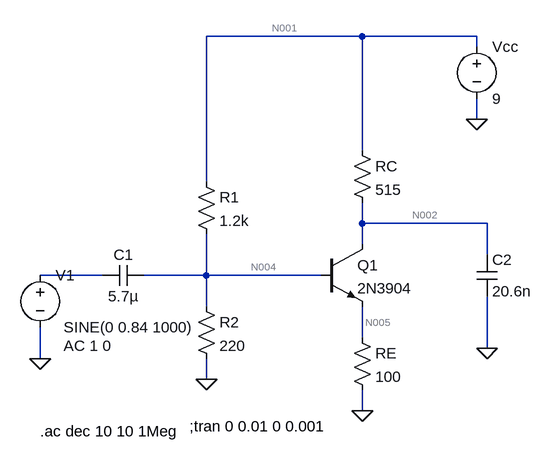
[diagram p0: schematic CE_amp.asc]
CE_amp.asc, the LTspice schematic file:
Version 4
SHEET 1 1264 680
WIRE 384 -208 144 -208
WIRE 560 -208 384 -208
WIRE 560 -192 560 -208
WIRE 560 -80 560 -112
WIRE 384 -32 384 -208
WIRE 144 16 144 -208
WIRE 384 80 384 48
WIRE 576 80 384 80
WIRE 384 112 384 80
WIRE 576 128 576 80
WIRE -16 160 -112 160
WIRE 144 160 144 96
WIRE 144 160 48 160
WIRE 320 160 144 160
WIRE 144 208 144 160
WIRE 384 256 384 208
WIRE 576 272 576 192
WIRE -112 288 -112 240
WIRE 144 320 144 288
WIRE 384 368 384 336
FLAG -112 288 0
FLAG 144 320 0
FLAG 384 368 0
FLAG 560 -80 0
FLAG 576 272 0
SYMBOL cap 48 144 R90
WINDOW 0 0 32 VBottom 2
WINDOW 3 32 32 VTop 2
SYMATTR InstName C1
SYMATTR Value 5.7µ
SYMBOL voltage -112 144 R0
WINDOW 3 36 96 Left 2
WINDOW 123 36 124 Left 2
WINDOW 39 0 0 Left 2
SYMATTR InstName V1
SYMATTR Value SINE(0 0.84 1000)
SYMATTR Value2 AC 1 0
SYMATTR SpiceLine ""
SYMBOL res 128 0 R0
SYMATTR InstName R1
SYMATTR Value 1.2k
SYMBOL res 128 192 R0
SYMATTR InstName R2
SYMATTR Value 220
SYMATTR SpiceLine ""
SYMBOL npn 320 112 R0
SYMATTR InstName Q1
SYMATTR Value 2N3904
SYMBOL res 368 -48 R0
SYMATTR InstName RC
SYMATTR Value 515
SYMBOL res 368 240 R0
SYMATTR InstName RE
SYMATTR Value 100
SYMBOL cap 560 128 R0
SYMATTR InstName C2
SYMATTR Value 20.6n
SYMBOL voltage 560 -208 R0
SYMATTR InstName Vcc
SYMATTR Value 9
TEXT 118 392 Left 2 !;tran 0 0.01 0 0.001
TEXT -112 400 Left 2 !.ac dec 10 10 1Meg

The netlist it stands for:
* CE_amp.asc
C1 N004 N003 5.7µ
V1 N003 0 SINE(0 0.84 1000) AC 1 0
R1 N001 N004 1.2k
R2 N004 0 220
Q1 N002 N004 N005 0 2N3904
RC N001 N002 515
RE N005 0 100
C2 N002 0 20.6n
Vcc N001 0 9
.model NPN NPN
.model PNP PNP
.lib standard.bjt
;tran 0 0.01 0 0.001
.ac dec 10 10 1Meg
.backanno
.end

* Results of the author's LTspice run, read from the files saved beside the schematic
* Operating Point, zero values left out:
*   V(n004) = 1.39 V
*   V(n001) = 9 V
*   V(n002) = 5.484 V
*   V(n005) = 684.9 mV
*   Ic(Q1) = 6.827 mA
*   Ib(Q1) = 22.22 µA
*   Ie(Q1) = -6.849 mA
*   I(Re) = 6.849 mA
*   I(Rc) = 6.827 mA
*   I(R2) = 6.319 mA
*   I(R1) = 6.341 mA
*   I(Vcc) = -13.17 mA
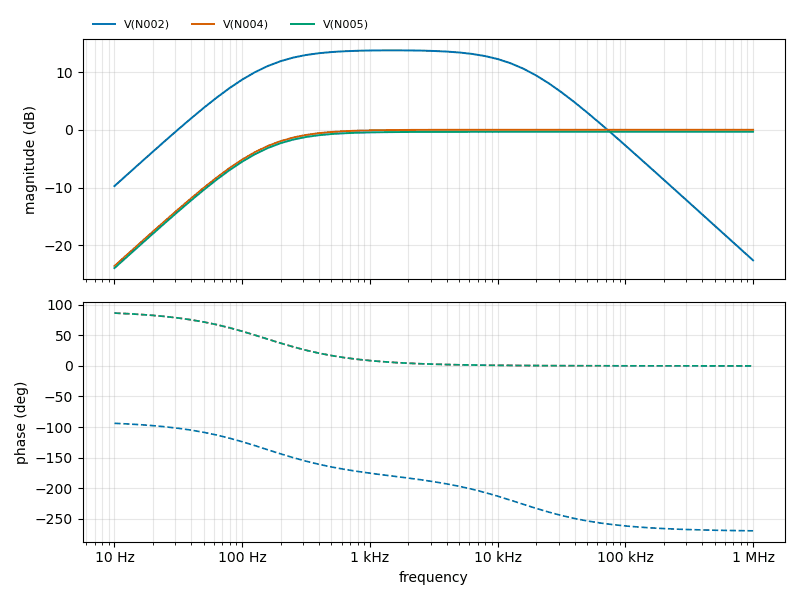
[diagram p1: AC Analysis of CE_amp.asc, plotted from the saved traces]
* AC Analysis, 1 run:
*   V(N002): -9.75 dB at 10 Hz, -22.62 dB at 1 MHz, peak 13.76 dB at 1.585 kHz, 3 dB below the peak at 148.9 Hz and 15.27 kHz
*   V(N004): -23.60 dB at 10 Hz, -0.00 dB at 1 MHz, peak -0.00 dB at 1 MHz, 3 dB below the peak at 151.7 Hz
*   V(N005): -23.96 dB at 10 Hz, -0.34 dB at 1 MHz, peak -0.34 dB at 631 kHz, 3 dB below the peak at 152.1 Hz